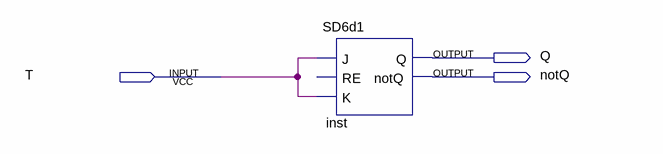
[diagram p0: schematic sheet]
// Quartus schematic flip-flop-t.bdf as structural Verilog: 1 symbols, 3 pins
module \flip-flop-t  (
  input  T,
  output Q,
  output notQ
);

  SD6d1 inst (.J(T), .K(T), .Q(Q), .notQ(notQ));  // open: RE
endmodule
